# Altium schematic sheet MB_peripherial.SchDoc
size 840 x 594 mm; SheetNumber: 8; SheetTotal: 8
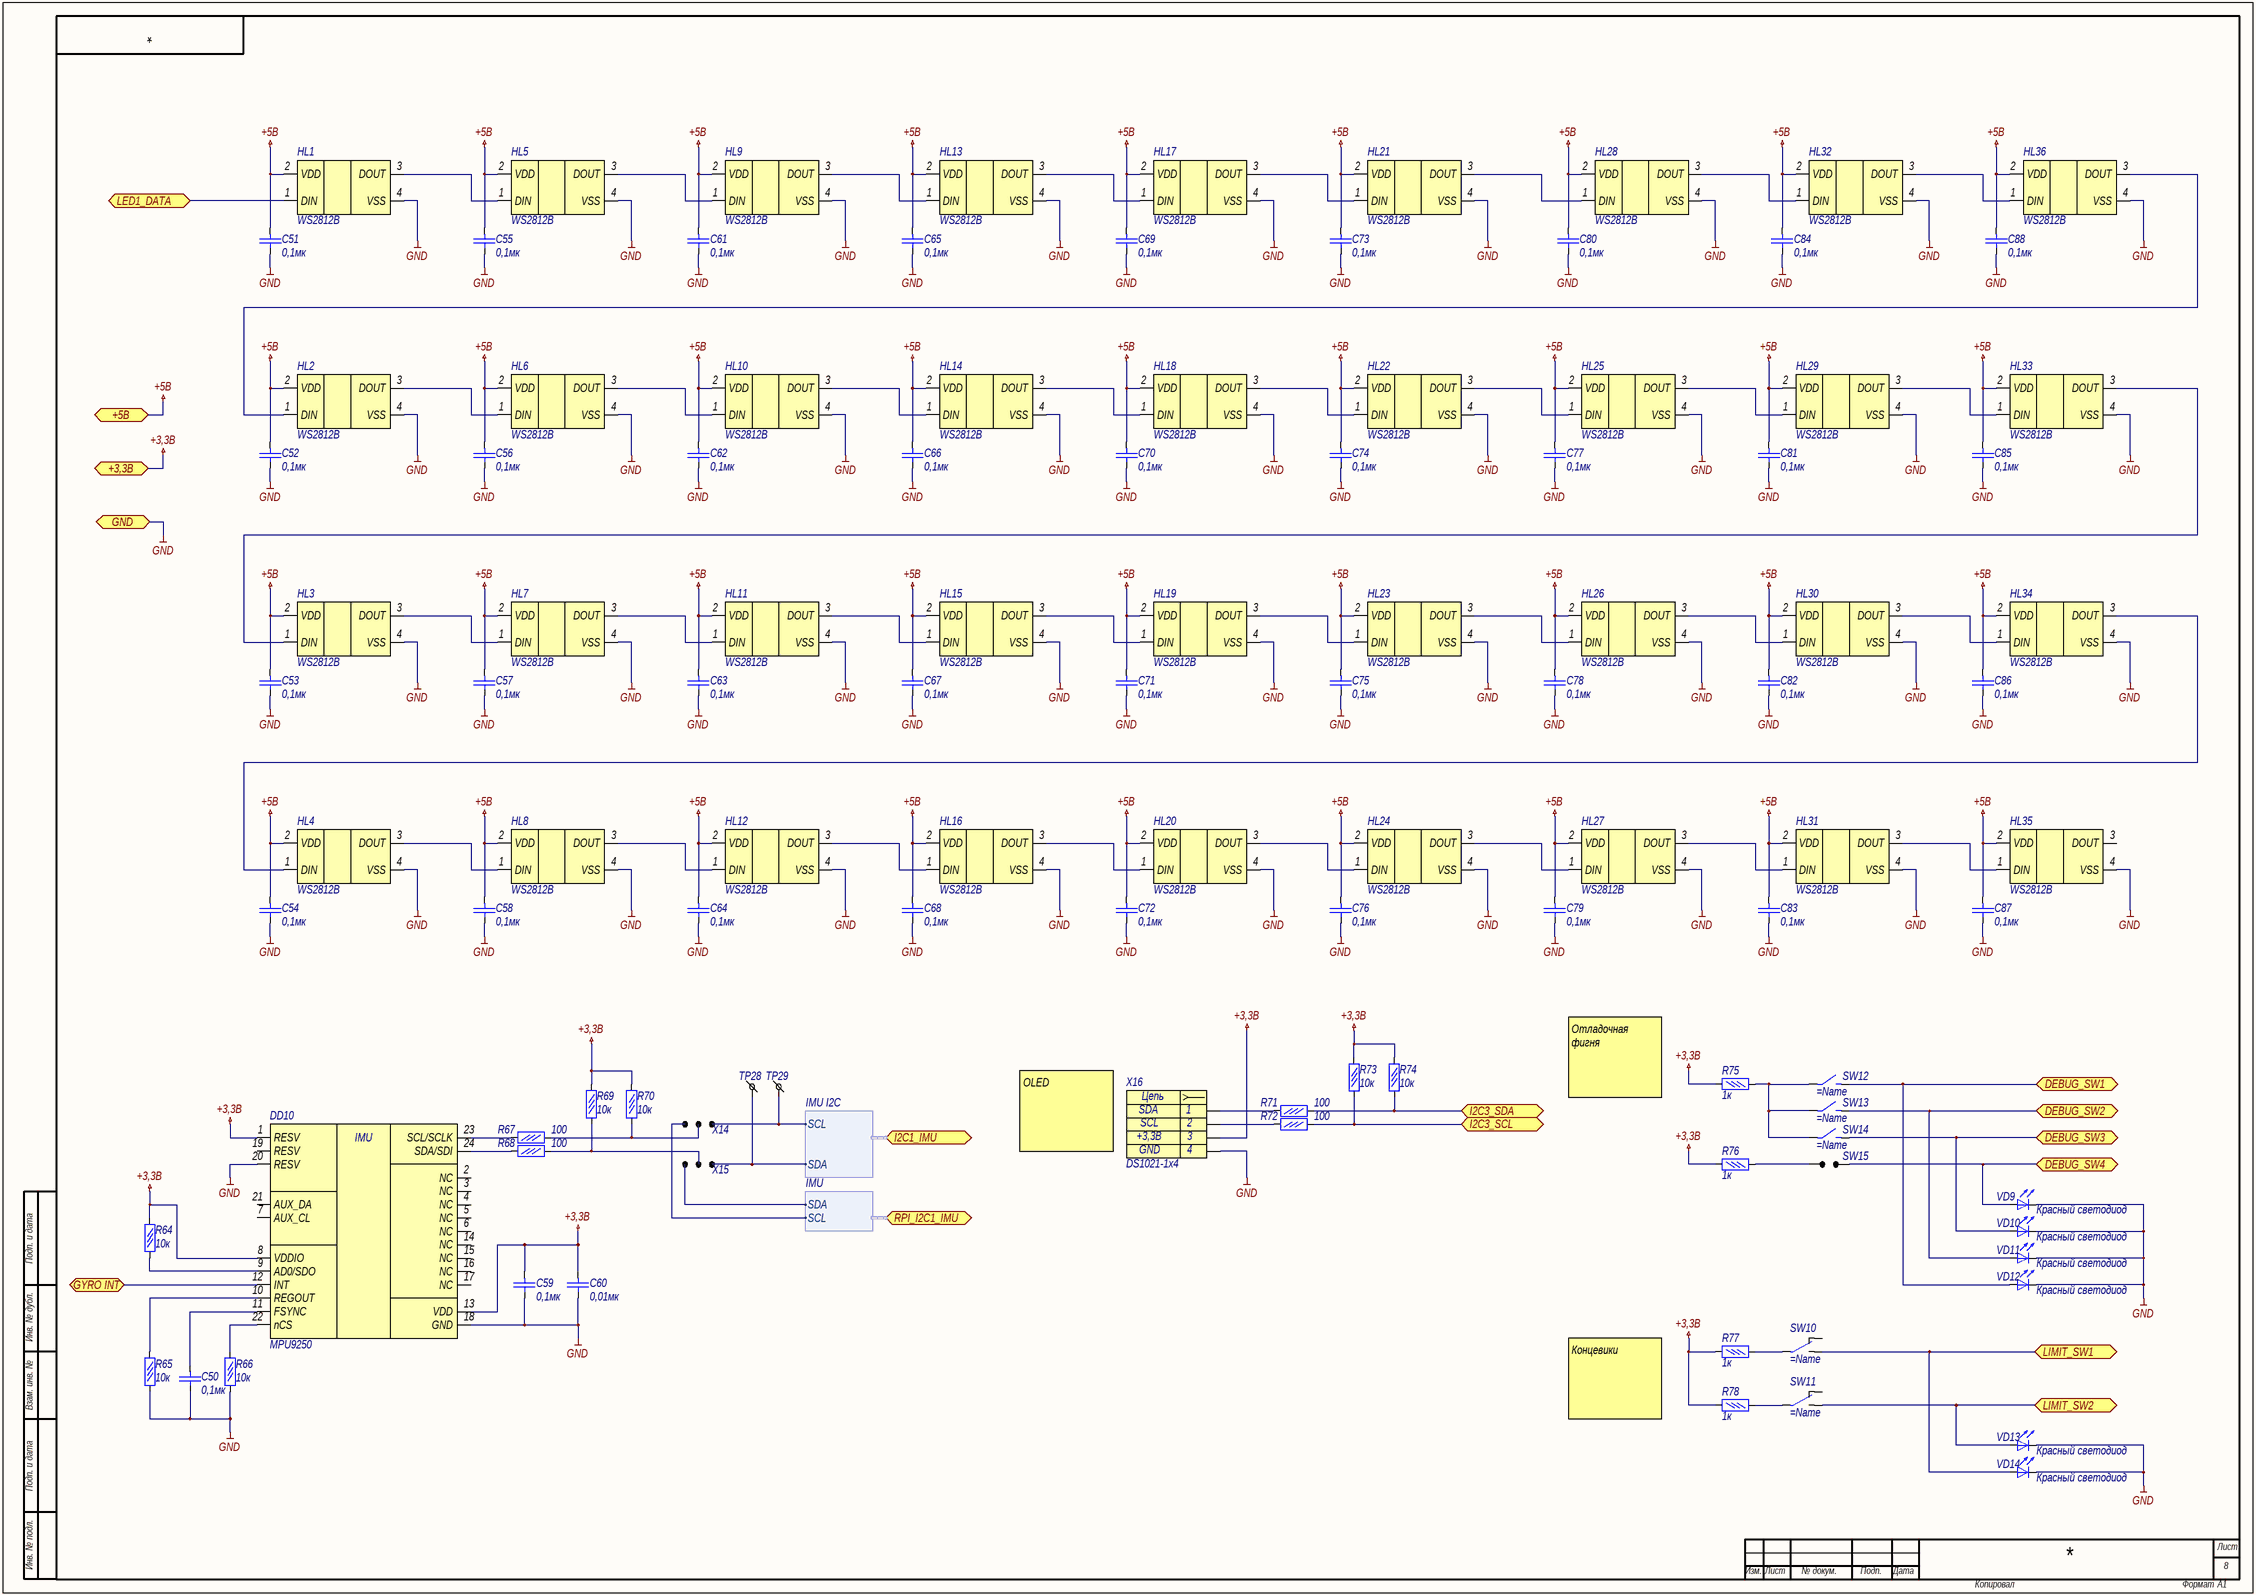
[diagram p0: MB_peripherial.SchDoc]

## Parts
DD10  MPU9250  [QFN24-PAD]
HL1  WS2812B  [ws2812b 4020]
HL2  WS2812B  [ws2812b 4020]
HL3  WS2812B  [ws2812b 4020]
HL4  WS2812B  [ws2812b 4020]
HL5  WS2812B  [ws2812b 4020]
HL6  WS2812B  [ws2812b 4020]
HL7  WS2812B  [ws2812b 4020]
HL8  WS2812B  [ws2812b 4020]
HL9  WS2812B  [ws2812b 4020]
HL10  WS2812B  [ws2812b 4020]
HL11  WS2812B  [ws2812b 4020]
HL12  WS2812B  [ws2812b 4020]
HL13  WS2812B  [ws2812b 4020]
HL14  WS2812B  [ws2812b 4020]
HL15  WS2812B  [ws2812b 4020]
HL16  WS2812B  [ws2812b 4020]
HL17  WS2812B  [ws2812b 4020]
HL18  WS2812B  [ws2812b 4020]
HL19  WS2812B  [ws2812b 4020]
HL20  WS2812B  [ws2812b 4020]
HL21  WS2812B  [ws2812b 4020]
HL22  WS2812B  [ws2812b 4020]
HL23  WS2812B  [ws2812b 4020]
HL24  WS2812B  [ws2812b 4020]
HL25  WS2812B  [ws2812b 4020]
HL26  WS2812B  [ws2812b 4020]
HL27  WS2812B  [ws2812b 4020]
HL28  WS2812B  [ws2812b 4020]
HL29  WS2812B  [ws2812b 4020]
HL30  WS2812B  [ws2812b 4020]
HL31  WS2812B  [ws2812b 4020]
HL32  WS2812B  [ws2812b 4020]
HL33  WS2812B  [ws2812b 4020]
HL34  WS2812B  [ws2812b 4020]
HL35  WS2812B  [ws2812b 4020]
HL36  WS2812B  [ws2812b 4020]
R64  10к  [R0402]
R65  10к  [R0402]
R66  10к  [R0402]
R67  100  [R0402]
R68  100  [R0402]
R69  10к  [R0402]
R70  10к  [R0402]
R71  100  [R0402]
R72  100  [R0402]
R73  10к  [R0402]
R74  10к  [R0402]
R75  1к  [R0402]
R76  1к  [R0402]
R77  1к  [R0402]
R78  1к  [R0402]
SW10  (no value)  [limit switch]
SW11  (no value)  [limit switch]
SW12  (no value)  [it-1187]
SW13  (no value)  [it-1187]
SW14  (no value)  [OMRON_B3U-1000P]
SW15  (no value)  [PLD 1.27X2]
TP28  TestPoint  [0.5 x 0,9_round]  (value not drawn)
TP29  TestPoint  [0.5 x 0,9_round]  (value not drawn)
VD9  Красный светодиод  [0603 - led]
VD10  Красный светодиод  [0603 - led]
VD11  Красный светодиод  [0603 - led]
VD12  Красный светодиод  [0603 - led]
VD13  Красный светодиод  [0603 - led]
VD14  Красный светодиод  [0603 - led - no point]
X14  Jumper_3  [solid_jumper_3]  (value not drawn)  (no BOM)
X15  Jumper_3  [solid_jumper_3]  (value not drawn)  (no BOM)
X16  DS1021-1x4  [PLS_1x4 - emty]
С50  0,1мк  [C0402]
С51  0,1мк  [C0402]
С52  0,1мк  [C0402]
С53  0,1мк  [C0402]
С54  0,1мк  [C0402]
С55  0,1мк  [C0402]
С56  0,1мк  [C0402]
С57  0,1мк  [C0402]
С58  0,1мк  [C0402]
С59  0,1мк  [C0402]
С60  0,01мк  [C0402]
С61  0,1мк  [C0402]
С62  0,1мк  [C0402]
С63  0,1мк  [C0402]
С64  0,1мк  [C0402]
С65  0,1мк  [C0402]
С66  0,1мк  [C0402]
С67  0,1мк  [C0402]
С68  0,1мк  [C0402]
С69  0,1мк  [C0402]
С70  0,1мк  [C0402]
С71  0,1мк  [C0402]
С72  0,1мк  [C0402]
С73  0,1мк  [C0402]
С74  0,1мк  [C0402]
С75  0,1мк  [C0402]
С76  0,1мк  [C0402]
С77  0,1мк  [C0402]
С78  0,1мк  [C0402]
С79  0,1мк  [C0402]
С80  0,1мк  [C0402]
С81  0,1мк  [C0402]
С82  0,1мк  [C0402]
С83  0,1мк  [C0402]
С84  0,1мк  [C0402]
С85  0,1мк  [C0402]
С86  0,1мк  [C0402]
С87  0,1мк  [C0402]
С88  0,1мк  [C0402]

## Ports
+3,3В (bidir), +5В (bidir), DEBUG_SW1 (bidir), DEBUG_SW2 (bidir), DEBUG_SW3 (bidir), DEBUG_SW4 (bidir), GND (bidir), GYRO INT (bidir), I2C1_IMU (bidir, harness IMU I2C), I2C3_SCL (bidir), I2C3_SDA (bidir), LED1_DATA (bidir), LIMIT_SW1 (bidir), LIMIT_SW2 (bidir), RPI_I2C1_IMU (bidir, harness IMU)

## Harnesses
IMU I2C: SDA, SCL
IMU: SDA, SCL

## Nets
+3,3В: DD10.1(RESV) DD10.8(VDDIO) DD10.13(VDD) R64.2 R69.2 R70.2 R73.2 R74.2 R75.2 R76.2 R77.2 R78.2 X16.3 С59.2 С60.2 ; port +3,3В
+5В: HL1.2(VDD) HL2.2(VDD) HL3.2(VDD) HL4.2(VDD) HL5.2(VDD) HL6.2(VDD) HL7.2(VDD) HL8.2(VDD) HL9.2(VDD) HL10.2(VDD) HL11.2(VDD) HL12.2(VDD) HL13.2(VDD) HL14.2(VDD) HL15.2(VDD) HL16.2(VDD) HL17.2(VDD) HL18.2(VDD) HL19.2(VDD) HL20.2(VDD) HL21.2(VDD) HL22.2(VDD) HL23.2(VDD) HL24.2(VDD) HL25.2(VDD) HL26.2(VDD) HL27.2(VDD) HL28.2(VDD) HL29.2(VDD) HL30.2(VDD) HL31.2(VDD) HL32.2(VDD) HL33.2(VDD) HL34.2(VDD) HL35.2(VDD) HL36.2(VDD) С51.2 С52.2 С53.2 С54.2 С55.2 С56.2 С57.2 С58.2 С61.2 С62.2 С63.2 С64.2 С65.2 С66.2 С67.2 С68.2 С69.2 С70.2 С71.2 С72.2 С73.2 С74.2 С75.2 С76.2 С77.2 С78.2 С79.2 С80.2 С81.2 С82.2 С83.2 С84.2 С85.2 С86.2 С87.2 С88.2 ; port +5В
GND: DD10.18(GND) DD10.20(RESV) HL1.4(VSS) HL2.4(VSS) HL3.4(VSS) HL4.4(VSS) HL5.4(VSS) HL6.4(VSS) HL7.4(VSS) HL8.4(VSS) HL9.4(VSS) HL10.4(VSS) HL11.4(VSS) HL12.4(VSS) HL13.4(VSS) HL14.4(VSS) HL15.4(VSS) HL16.4(VSS) HL17.4(VSS) HL18.4(VSS) HL19.4(VSS) HL20.4(VSS) HL21.4(VSS) HL22.4(VSS) HL23.4(VSS) HL24.4(VSS) HL25.4(VSS) HL26.4(VSS) HL27.4(VSS) HL28.4(VSS) HL29.4(VSS) HL30.4(VSS) HL31.4(VSS) HL32.4(VSS) HL33.4(VSS) HL34.4(VSS) HL35.4(VSS) HL36.4(VSS) R65.1 R66.1 VD9.2(K) VD10.2(K) VD11.2(K) VD12.2(K) VD13.2(K) VD14.2(K) X16.4 С50.1 С51.1 С52.1 С53.1 С54.1 С55.1 С56.1 С57.1 С58.1 С59.1 С60.1 С61.1 С62.1 С63.1 С64.1 С65.1 С66.1 С67.1 С68.1 С69.1 С70.1 С71.1 С72.1 С73.1 С74.1 С75.1 С76.1 С77.1 С78.1 С79.1 С80.1 С81.1 С82.1 С83.1 С84.1 С85.1 С86.1 С87.1 С88.1 ; port GND
DEBUG_SW1: SW12.2 VD12.1(A) ; port DEBUG_SW1
DEBUG_SW2: SW13.2 VD11.1(A) ; port DEBUG_SW2
DEBUG_SW3: SW14.2 VD10.1(A) ; port DEBUG_SW3
DEBUG_SW4: SW15.2 VD9.1(A) ; port DEBUG_SW4
GYRO INT: DD10.12(INT) ; port GYRO INT
I2C3_SCL: R72.1 R73.1 ; port I2C3_SCL
I2C3_SDA: R71.1 R74.1 ; port I2C3_SDA
LED1_DATA: HL1.1(DIN) ; port LED1_DATA
LIMIT_SW1: SW10.1 VD14.1(A) ; port LIMIT_SW1
LIMIT_SW2: SW11.1 VD13.1(A) ; port LIMIT_SW2
NetDD10_9: DD10.9(AD0/SDO) R64.1
NetDD10_10: DD10.10(REGOUT) R65.2
NetDD10_11: DD10.11(FSYNC) С50.2
NetDD10_22: DD10.22(nCS) R66.2
NetDD10_23: DD10.23(SCL/SCLK) R67.2
NetDD10_24: DD10.24(SDA/SDI) R68.2
NetHL1_3: HL1.3(DOUT) HL5.1(DIN)
NetHL2_1: HL2.1(DIN) HL36.3(DOUT)
NetHL2_3: HL2.3(DOUT) HL6.1(DIN)
NetHL3_1: HL3.1(DIN) HL33.3(DOUT)
NetHL3_3: HL3.3(DOUT) HL7.1(DIN)
NetHL4_1: HL4.1(DIN) HL34.3(DOUT)
NetHL4_3: HL4.3(DOUT) HL8.1(DIN)
NetHL5_3: HL5.3(DOUT) HL9.1(DIN)
NetHL6_3: HL6.3(DOUT) HL10.1(DIN)
NetHL7_3: HL7.3(DOUT) HL11.1(DIN)
NetHL8_3: HL8.3(DOUT) HL12.1(DIN)
NetHL9_3: HL9.3(DOUT) HL13.1(DIN)
NetHL10_3: HL10.3(DOUT) HL14.1(DIN)
NetHL11_3: HL11.3(DOUT) HL15.1(DIN)
NetHL12_3: HL12.3(DOUT) HL16.1(DIN)
NetHL13_3: HL13.3(DOUT) HL17.1(DIN)
NetHL14_3: HL14.3(DOUT) HL18.1(DIN)
NetHL15_3: HL15.3(DOUT) HL19.1(DIN)
NetHL16_3: HL16.3(DOUT) HL20.1(DIN)
NetHL17_3: HL17.3(DOUT) HL21.1(DIN)
NetHL18_3: HL18.3(DOUT) HL22.1(DIN)
NetHL19_3: HL19.3(DOUT) HL23.1(DIN)
NetHL20_3: HL20.3(DOUT) HL24.1(DIN)
NetHL21_3: HL21.3(DOUT) HL28.1(DIN)
NetHL22_3: HL22.3(DOUT) HL25.1(DIN)
NetHL23_3: HL23.3(DOUT) HL26.1(DIN)
NetHL24_3: HL24.3(DOUT) HL27.1(DIN)
NetHL25_3: HL25.3(DOUT) HL29.1(DIN)
NetHL26_3: HL26.3(DOUT) HL30.1(DIN)
NetHL27_3: HL27.3(DOUT) HL31.1(DIN)
NetHL28_3: HL28.3(DOUT) HL32.1(DIN)
NetHL29_3: HL29.3(DOUT) HL33.1(DIN)
NetHL30_3: HL30.3(DOUT) HL34.1(DIN)
NetHL31_3: HL31.3(DOUT) HL35.1(DIN)
NetHL32_3: HL32.3(DOUT) HL36.1(DIN)
NetR67_1: R67.1 R70.1 X14.2
NetR68_1: R68.1 R69.1 X15.2
NetR71_2: R71.2 X16.1
NetR72_2: R72.2 X16.2
NetR75_1: R75.1 SW12.1 SW13.1 SW14.1
NetR76_1: R76.1 SW15.1
NetR77_1: R77.1 SW10.3
NetR78_1: R78.1 SW11.3
NetTP28_1: TP28.1 X15.1 ; port I2C1_IMU.SDA
NetTP29_1: TP29.1 X14.1 ; port I2C1_IMU.SCL
NetX14_3: X14.3 ; port RPI_I2C1_IMU.SCL
NetX15_3: X15.3 ; port RPI_I2C1_IMU.SDA

Not connected (* = marked no-connect by the designer): DD10 2(NC) 3(NC) 4(NC) 5(NC) 6(NC) 7(AUX_CL) 14(NC) 15(NC) 16(NC) 17(NC) 19(RESV) 21(AUX_DA); HL35 3(DOUT); SW10 2; SW11 2

## Notes on the sheet
- Отладочная фигня
- OLED
- Концевики
- Подп. и дата
- Инв. № дубл.
- Взам. инв. №
- Инв. № подл.
- Лист
- Изм.
- № докум.
- Подп.
- Дата
- Копировал
- Формат
- А1
- (in symbol MPU9250) IMU
- (in symbol PLS 1 x 4) Цепь

## Library data of the parts
HL1-HL36 = WS2812B: адресный светодиод на микросхеме WS2812b; Name: WS2812B
R64-R78 = Резистор 0.05Вт: Резистор 0,05Вт
  R64-R66 R69 R70 R73 R74: Value: 10к
  R67 R68 R71 R72: Value: 100
  R75-R78: Value: 1к
SW10 SW11 = Концевой выключатель
SW12-SW14 = button
SW15 = Jumper: Перемычка
VD9-VD14 = SMD светодиод: Светодтод SMD; Name: Красный светодиод
X14 X15 = Jumper x3: Перемычка паяльная на плате; ID: 28; Name: SW_Jumper_3_pins; Основной тип: Места под пайку; Доп_Тип: Перемычки; Тип корпуса: 0805; Value: Jumper_3
X16 = PLS 1 x 4: Contact_1: SDA; Contact_2: SCL; Contact_3: +3,3В; Contact_4: GND; Name: DS1021-1x4
С50-С88 = Кер. конденсатор
  С50-С59 С61-С88: Value: 0,1мк
  С60: Value: 0,01мк
DD10 = MPU9250: Name: MPU9250